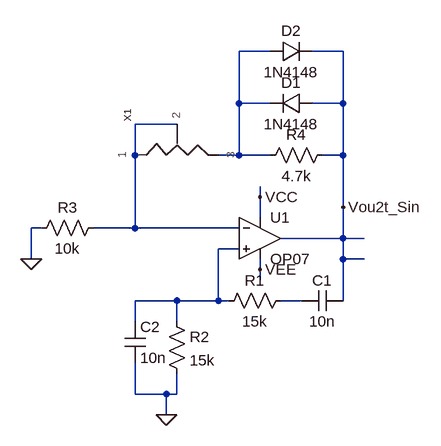
[diagram p0: schematic 1_9.asc]
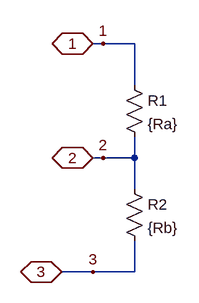
[diagram p1: sub-circuit dian_wei_qi.asc]
1_9.asc, the LTspice schematic file:
Version 4
SHEET 1 880 680
WIRE 592 -128 544 -128
WIRE 704 -128 656 -128
WIRE 544 -48 544 -128
WIRE 592 -48 544 -48
WIRE 704 -48 704 -128
WIRE 704 -48 656 -48
WIRE 448 -16 384 -16
WIRE 384 32 384 -16
WIRE 544 32 544 -48
WIRE 544 32 512 32
WIRE 592 32 544 32
WIRE 704 32 704 -48
WIRE 704 32 672 32
WIRE 576 96 576 80
WIRE 704 112 704 32
WIRE 576 128 576 96
WIRE 240 144 224 144
WIRE 384 144 384 32
WIRE 384 144 320 144
WIRE 544 144 384 144
WIRE 704 160 704 112
WIRE 704 160 608 160
WIRE 736 160 704 160
WIRE 544 176 512 176
WIRE 224 192 224 144
WIRE 704 192 704 160
WIRE 736 192 704 192
WIRE 576 208 576 192
WIRE 576 224 576 208
WIRE 448 256 384 256
WIRE 512 256 512 176
WIRE 512 256 448 256
WIRE 528 256 512 256
WIRE 640 256 608 256
WIRE 704 256 704 192
WIRE 384 288 384 256
WIRE 448 288 448 256
WIRE 384 400 384 352
WIRE 432 400 384 400
WIRE 448 400 448 368
WIRE 448 400 432 400
WIRE 432 432 432 400
FLAG 224 192 0
FLAG 432 432 0
FLAG 576 96 VCC
FLAG 576 208 VEE
FLAG 704 112 Vou2t_Sin
SYMBOL OpAmps\\OP07 576 96 R0
SYMATTR InstName U1
SYMBOL res 624 240 R90
WINDOW 0 0 56 VBottom 2
WINDOW 3 32 56 VTop 2
SYMATTR InstName R1
SYMATTR Value 15k
SYMBOL cap 704 240 R90
WINDOW 0 0 32 VBottom 2
WINDOW 3 32 32 VTop 2
SYMATTR InstName C1
SYMATTR Value 10n
SYMBOL res 432 272 R0
SYMATTR InstName R2
SYMATTR Value 15k
SYMBOL cap 368 288 R0
SYMATTR InstName C2
SYMATTR Value 10n
SYMBOL res 336 128 R90
WINDOW 0 0 56 VBottom 2
WINDOW 3 32 56 VTop 2
SYMATTR InstName R3
SYMATTR Value 10k
SYMBOL dian_wei_qi 448 48 R270
SYMATTR InstName X1
SYMATTR SpiceLine Ra=1,Rb=16.5k
SYMBOL res 688 16 R90
WINDOW 0 0 56 VBottom 2
WINDOW 3 32 56 VTop 2
SYMATTR InstName R4
SYMATTR Value 4.7k
SYMBOL diode 656 -64 R90
WINDOW 0 0 32 VBottom 2
WINDOW 3 32 32 VTop 2
SYMATTR InstName D1
SYMATTR Value 1N4148
SYMBOL diode 592 -112 R270
WINDOW 0 32 32 VTop 2
WINDOW 3 0 32 VBottom 2
SYMATTR InstName D2
SYMATTR Value 1N4148

dian_wei_qi.asc, the sub-circuit schematic file:
Version 4
SHEET 1 880 680
WIRE 144 -32 128 -32
WIRE 192 -32 144 -32
WIRE 192 32 192 -32
WIRE 144 144 128 144
WIRE 192 144 192 112
WIRE 192 144 144 144
WIRE 192 192 192 144
WIRE 128 320 80 320
WIRE 192 320 192 272
WIRE 192 320 128 320
FLAG 144 -32 1
FLAG 144 144 2
FLAG 128 320 3
FLAG 128 -32 1
IOPIN 128 -32 BiDir
FLAG 128 144 2
IOPIN 128 144 BiDir
FLAG 80 320 3
IOPIN 80 320 BiDir
SYMBOL res 176 16 R0
SYMATTR InstName R1
SYMATTR Value {Ra}
SYMBOL res 176 176 R0
SYMATTR InstName R2
SYMATTR Value {Rb}

The netlist it stands for:
* 1_9.asc
XU1 N003 N002 VCC VEE Vou2t_Sin LT1001  ; OP07, pins In+ In- V+ V- OUT
R1 N004 N003 15k
C1 Vou2t_Sin N004 10n
R2 N003 0 15k
C2 N003 0 10n
R3 N002 0 10k
XX1 N002 N002 N001 dian_wei_qi params: Ra=1,Rb=16.5k
R4 Vou2t_Sin N001 4.7k
D1 Vou2t_Sin N001 1N4148
D2 N001 Vou2t_Sin 1N4148

* block symbol definitions
.subckt dian_wei_qi 1 2 3
R1 1 2 {Ra}
R2 2 3 {Rb}
.ends dian_wei_qi

.model D D
.lib standard.dio
.lib LTC.lib
.backanno
.end